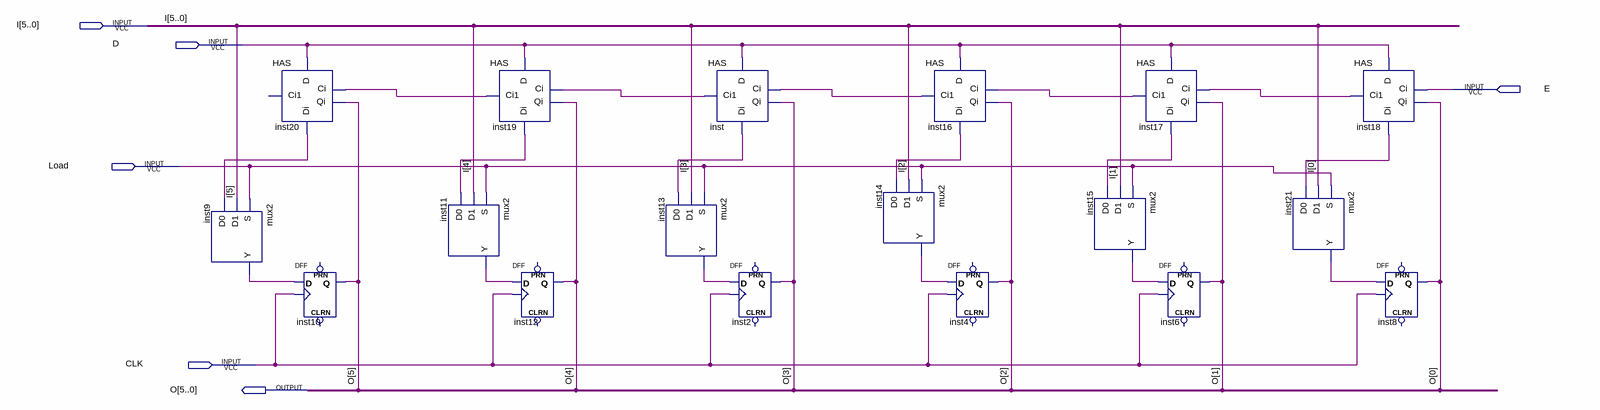
[diagram p0: schematic sheet]
// Quartus schematic counter_6bits.bdf as structural Verilog: 18 symbols, 6 pins
module counter_6bits (
  input  [5:0] I,
  input  D,
  input  E,
  input  Load,
  input  CLK,
  output [5:0] O
);

  wire inst9_y, inst11_y, inst13_y, inst14_y, inst15_y, inst16_ci1, inst16_di, inst17_ci1, inst17_di,
       inst18_ci1, inst18_di, inst19_ci1, inst19_di, inst20_di, inst21_y, inst_ci1, inst_di;

  mux2 inst9 (.S(Load), .D1(I[5]), .D0(inst20_di), .Y(inst9_y));
  HAS inst20 (.D(D), .Ci(inst19_ci1), .Qi(O[5]), .Di(inst20_di));  // open: Ci1
  DFF inst10 (.CLK(CLK), .D(inst9_y), .Q(O[5]));  // open: CLRN, PRN
  mux2 inst11 (.S(Load), .D1(I[4]), .D0(inst19_di), .Y(inst11_y));
  HAS inst19 (.D(D), .Ci(inst_ci1), .Qi(O[4]), .Ci1(inst19_ci1), .Di(inst19_di));
  DFF inst12 (.CLK(CLK), .D(inst11_y), .Q(O[4]));  // open: CLRN, PRN
  mux2 inst13 (.S(Load), .D1(I[3]), .D0(inst_di), .Y(inst13_y));
  HAS inst (.D(D), .Ci(inst16_ci1), .Qi(O[3]), .Ci1(inst_ci1), .Di(inst_di));
  DFF inst2 (.CLK(CLK), .D(inst13_y), .Q(O[3]));  // open: CLRN, PRN
  mux2 inst14 (.S(Load), .D1(I[2]), .D0(inst16_di), .Y(inst14_y));
  HAS inst16 (.D(D), .Ci(inst17_ci1), .Qi(O[2]), .Ci1(inst16_ci1), .Di(inst16_di));
  DFF inst4 (.CLK(CLK), .D(inst14_y), .Q(O[2]));  // open: CLRN, PRN
  mux2 inst15 (.S(Load), .D1(I[1]), .D0(inst17_di), .Y(inst15_y));
  HAS inst17 (.D(D), .Ci(inst18_ci1), .Qi(O[1]), .Ci1(inst17_ci1), .Di(inst17_di));
  DFF inst6 (.CLK(CLK), .D(inst15_y), .Q(O[1]));  // open: CLRN, PRN
  mux2 inst21 (.S(Load), .D1(I[0]), .D0(inst18_di), .Y(inst21_y));
  HAS inst18 (.D(D), .Ci(E), .Qi(O[0]), .Ci1(inst18_ci1), .Di(inst18_di));
  DFF inst8 (.CLK(CLK), .D(inst21_y), .Q(O[0]));  // open: CLRN, PRN
endmodule
